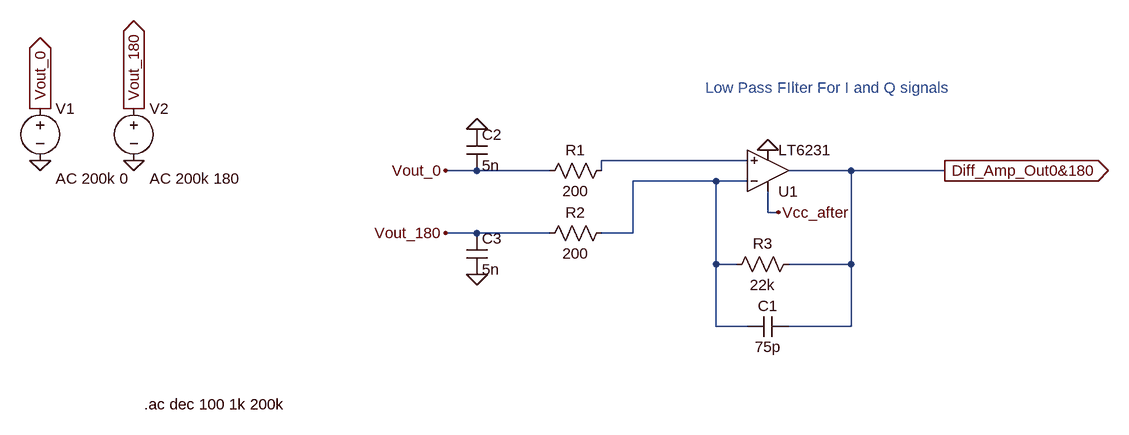
[diagram p0: schematic LowPass Filter Simulation.asc]
LowPass Filter Simulation.asc, the LTspice schematic file:
Version 4
SHEET 1 1004 696
WIRE 400 304 176 304
WIRE -16 320 -64 320
WIRE 96 320 -16 320
WIRE 176 320 176 304
WIRE 560 320 464 320
WIRE 704 320 560 320
WIRE 352 336 224 336
WIRE 400 336 352 336
WIRE 432 384 432 352
WIRE 448 384 432 384
WIRE -16 416 -64 416
WIRE 96 416 -16 416
WIRE 224 416 224 336
WIRE 224 416 176 416
WIRE 352 464 352 336
WIRE 384 464 352 464
WIRE 560 464 560 320
WIRE 560 464 464 464
WIRE 352 560 352 464
WIRE 400 560 352 560
WIRE 560 560 560 464
WIRE 560 560 464 560
FLAG 432 288 0
FLAG -16 256 0
FLAG -16 480 0
FLAG -64 320 Vout_0
FLAG -64 416 Vout_180
FLAG 448 384 Vcc_after
FLAG 704 320 Diff_Amp_Out0&180
IOPIN 704 320 Out
FLAG -688 304 0
FLAG -544 304 0
FLAG -688 224 Vout_0
IOPIN -688 224 Out
FLAG -544 224 Vout_180
IOPIN -544 224 Out
SYMBOL res 192 304 R90
WINDOW 0 0 56 VBottom 2
WINDOW 3 32 56 VTop 2
SYMATTR InstName R1
SYMATTR Value 200
SYMBOL res 192 400 R90
WINDOW 0 0 56 VBottom 2
WINDOW 3 32 56 VTop 2
SYMATTR InstName R2
SYMATTR Value 200
SYMBOL res 480 448 R90
WINDOW 0 0 56 VBottom 2
WINDOW 3 32 56 VTop 2
SYMATTR InstName R3
SYMATTR Value 22k
SYMBOL cap 464 544 R90
WINDOW 0 0 32 VBottom 2
WINDOW 3 32 32 VTop 2
SYMATTR InstName C1
SYMATTR Value 75p
SYMBOL cap -32 256 R0
SYMATTR InstName C2
SYMATTR Value 5n
SYMBOL cap -32 416 R0
SYMATTR InstName C3
SYMATTR Value 5n
SYMBOL OpAmps\\LT6231 432 320 M180
SYMATTR InstName U1
SYMBOL voltage -688 208 R0
WINDOW 123 24 124 Left 2
WINDOW 39 0 0 Left 0
SYMATTR InstName V1
SYMATTR Value ""
SYMATTR Value2 AC 200k 0
SYMBOL voltage -544 208 R0
WINDOW 123 24 124 Left 2
WINDOW 39 0 0 Left 0
SYMATTR InstName V2
SYMATTR Value ""
SYMATTR Value2 AC 200k 180
TEXT 336 192 Left 2 ;Low Pass FIlter For I and Q signals
TEXT -528 680 Left 2 !.ac dec 100 1k 200k

The netlist it stands for:
* LowPass Filter Simulation.asc
R1 N001 Vout_0 200
R2 N002 Vout_180 200
R3 Diff_Amp_Out0&180 N002 22k
C1 Diff_Amp_Out0&180 N002 75p
C2 0 Vout_0 5n
C3 Vout_180 0 5n
XU1 N001 N002 Diff_Amp_Out0&180 Vcc_after 0 LT6231  ; pins In+ In- OUT V+ V-
V1 Vout_0 0 AC 200k 0
V2 Vout_180 0 AC 200k 180
* Low Pass FIlter For I and Q signals
.ac dec 100 1k 200k
.lib LTC2.lib
.backanno
.end